# EAGLE design Roller Ball Lane (EAGLE 9.5.0)
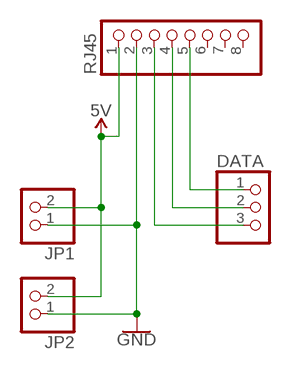
[diagram p0: schematic, sheet 1]

## Parts
DATA  PINHD-1X3  [1X03]
JP1  PINHD-1X2  [1X02]
JP2  PINHD-1X2  [1X02]
RJ45  PINHD-1X8  [1X08]

## Nets
5V: JP1.2 JP2.2 RJ45.1
GND: JP1.1 JP2.1 RJ45.2
N$3: DATA.3 RJ45.3
N$4: DATA.2 RJ45.4
N$5: DATA.1 RJ45.5
Unconnected: RJ45.6 RJ45.7 RJ45.8

## Library data of the parts
DATA = pinhead:PINHD-1X3: PIN HEADER
JP1 JP2 = pinhead:PINHD-1X2: PIN HEADER
RJ45 = pinhead:PINHD-1X8: PIN HEADER

## Board
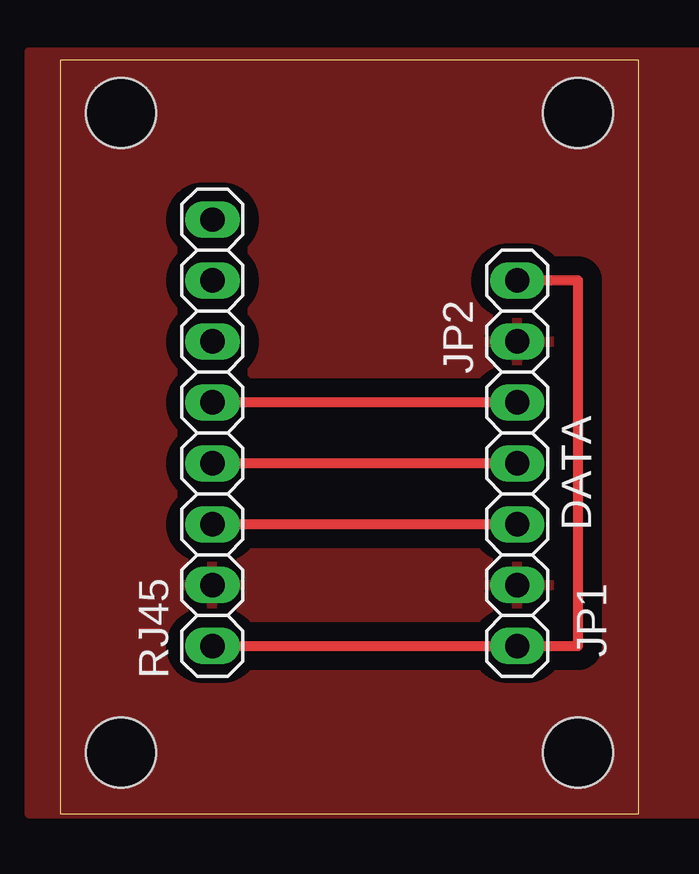
[diagram p1: board, top side]

Size 24.11 x 31.42 mm. Coordinates in mm from the lower left corner, seen from the top.
Outline: 0,0 24.11,0 24.11,31.42 0,31.42 0,0
Copper layers (1*16): Top 0.035mm / dielectric 1.5mm / Bottom 0.035mm
Design rules "OthermillDRC_1_32_v2": minimum track width 8mil, minimum drill 0.8mm, track to track 0.794003125mm, track to pad 0.794003125mm, pad to pad 0.794003125mm, via to via 0.794003125mm, smd to smd 0mil, copper to edge 0mil, drill to drill 1mil, minimum pad ring 10mil, minimum via ring 10mil, stop-mask expansion 1mil, vias tented up to drill 30mil, thermal gap 10mil
Holes 2.92 mm at 21.59,29.21 21.59,2.54 2.54,2.54 2.54,29.21

### Footprints (pad centres in the part's own frame; a part is rotated, then mirrored left to right if it is on the bottom)
1X03 = drill 1.016 long: 1 -2.54,0; 2 0,0; 3 2.54,0
1X02 = drill 1.016 long: 1 -1.27,0; 2 1.27,0
1X08 = drill 1.016 long: 1 -8.89,0; 2 -6.35,0; 3 -3.81,0; 4 -1.27,0; 5 1.27,0; 6 3.81,0; 7 6.35,0; 8 8.89,0

### Placement (x,y rotation side)
DATA  19.05,14.61 270 top
JP1  19.05,8.25 270 top
JP2  19.05,20.95 90 top
RJ45  6.35,15.88 90 top

### Tracks (layer width: path | path; a pad name or v marks a point on that pad's centre or on a via)
5V
  Top 0.406: JP2.2 21.59,22.22 21.59,6.98 JP1.2 RJ45.1
GND
  pour Top: -1.27,31.75 26.67,31.75 26.67,0 -1.27,0
N$3
  Top 0.406: DATA.3 RJ45.3
N$4
  Top 0.406: DATA.2 RJ45.4
N$5
  Top 0.406: DATA.1 RJ45.5